# EAGLE design encoder (EAGLE 9.3.1)
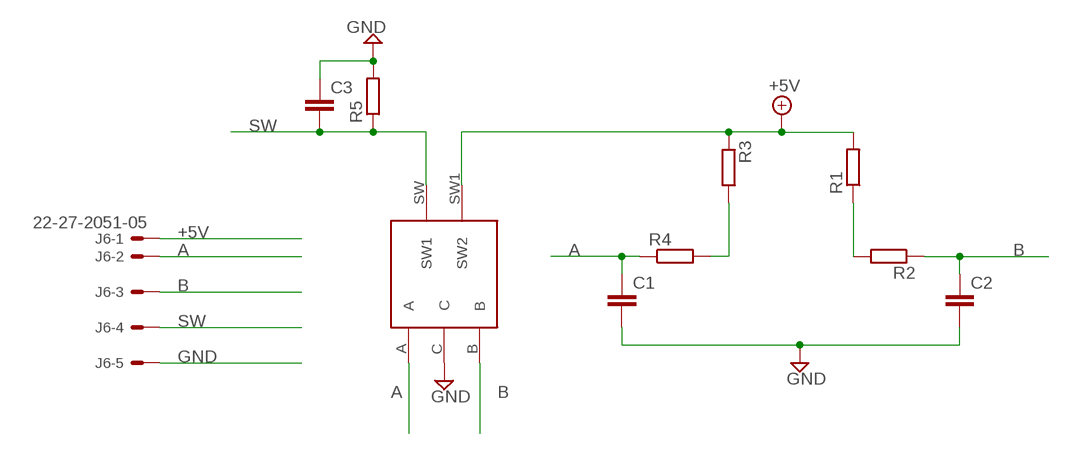
[diagram p0: schematic, sheet 1]

## Parts
C1  C-EUC0805  [C0805]
C2  C-EUC0805  [C0805]
C3  C-EUC0805  [C0805]
J6  22-27-2051-05  [6410-05]
R1  R-EU_MELF0204W  [MINI_MELF-0204W]
R2  R-EU_MELF0204W  [MINI_MELF-0204W]
R3  R-EU_MELF0204W  [MINI_MELF-0204W]
R4  R-EU_MELF0204W  [MINI_MELF-0204W]
R5  R-EU_MELF0204W  [MINI_MELF-0204W]
U$1  BOURNS_ROTARY  [BOURNS_ROTARY]

## Nets
+5V: J6.1 R1.2 R3.1 U$1.SW1(SW2)
A: C1.1 J6.2 R4.1 U$1.A
B: C2.1 J6.3 R2.1 U$1.B
GND: C1.2 C2.2 C3.1 J6.5 R5.2 U$1.C
N$1: R1.1 R2.2
N$2: R3.2 R4.2
SW: C3.2 J6.4 R5.1 U$1.SW(SW1)

## Library data of the parts
C1-C3 = Vwvwbg:C-EU: CAPACITOR, European symbol
J6 = con-molex:22-?-05: CONNECTOR wire to board 2.54 mm (.1 inch) pitch header; MF: MOLEX; OC_FARNELL: unknown; OC_NEWARK: unknown
R1-R5 = Vwvwbg:R-EU_: RESISTOR, European symbol
U$1 = Vwvwbg:BOURNS_ROTARY

## Board
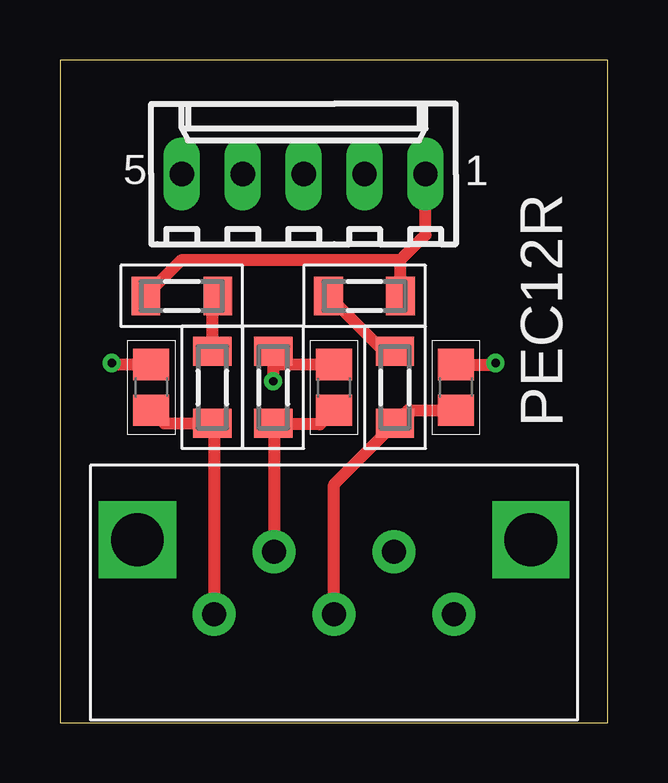
[diagram p1: board, top side]
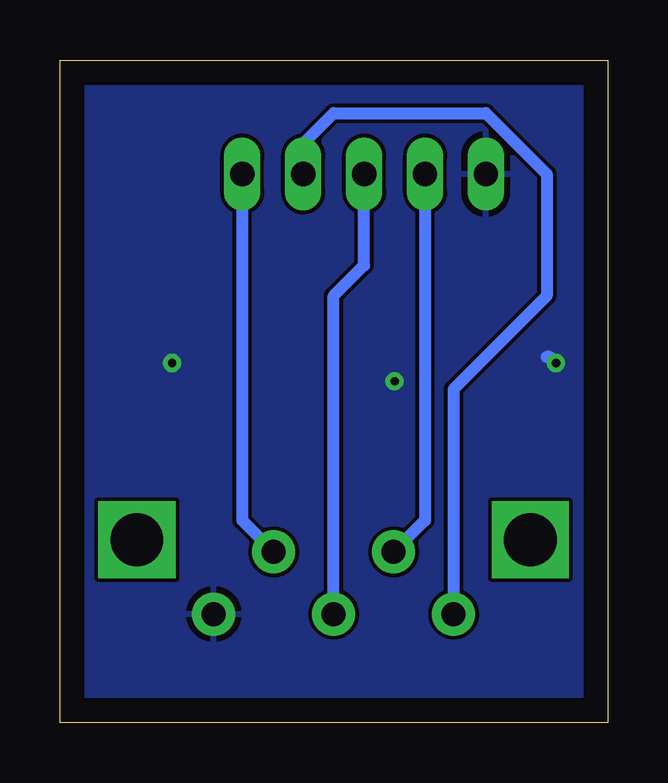
[diagram p2: board, bottom side, seen from below]

Size 22.84 x 27.61 mm. Coordinates in mm from the lower left corner, seen from the top.
Outline: 0,0 22.84,0 22.84,27.61 0,27.61 0,0
Copper layers (1*16): Top 0.035mm / dielectric 1.5mm / Bottom 0.035mm
Design rules "default": minimum track width 6mil, minimum drill 0.35mm, track to track 6mil, track to pad 6mil, pad to pad 6mil, via to via 6mil, smd to smd 6mil, copper to edge 40mil, drill to drill 6mil, minimum pad ring 10mil, minimum via ring 8mil, stop-mask expansion 4mil, vias tented up to drill 0mil, thermal gap 10mil

### Footprints (pad centres in the part's own frame; a part is rotated, then mirrored left to right if it is on the bottom)
C0805 = smd 1.3 x 1.5: 1 -0.95,0; 2 0.95,0
6410-05 = drill 1.016 long: 1 5.08,0; 2 2.54,0; 3 0,0; 4 -2.54,0; 5 -5.08,0
MINI_MELF-0204W = smd 1.2 x 1.6: 1 -1.5,0; 2 1.5,0
BOURNS_ROTARY = drill 1 pad 1.8: A -5,-3.1; B 0,-3.1; C 5,-3.1; SW -2.5,-0.5; SW1 2.5,-0.5 | drill 2.2 pad 3 square: P$6 -8.2,0; P$7 8.2,0

### Placement (x,y rotation side)
C1  3.81,13.97 90 top
C2  16.51,13.97 90 top
C3  11.43,13.97 270 top
J6  10.16,22.86 0 top
R1  12.7,17.78 0 top
R2  13.97,13.97 90 top
R3  5.08,17.78 0 top
R4  6.35,13.97 90 top
R5  8.89,13.97 90 top
U$1  11.43,7.62 0 top

### Tracks (layer width: path | path; a pad name or v marks a point on that pad's centre or on a via)
+5V
  Top 0.508: R1.2 14.2,19.28 | 14.2,19.28 15.24,20.32 J6.1 | R3.1 5.08,19.28 14.2,19.28
  Bottom 0.508: J6.1 15.24,8.43 U$1.SW1
A
  Top 0.508: C1.1 4.36,12.47 R4.1 6.43,12.39 U$1.A
  Bottom 0.508: J6.2 12.7,24.13 11.43,25.4 5.08,25.4 2.54,22.86 2.54,17.78 6.43,13.89 U$1.A
B
  Top 0.508: U$1.B 11.43,9.93 R2.1 14.52,13.02 C2.1
  Bottom 0.508: U$1.B 11.43,17.78 10.16,19.05 J6.3
GND  (via drill 0.35)
  Top 0.508: C1.2 2.22,14.92 v2.16,14.99 | R5.2 8.89,15.24 | 8.89,15.24 v8.89,14.22 | C3.1 9.21,14.92 8.89,15.24 | C2.2 18.09,14.92 v18.16,14.99
  Bottom 0.508: v2.16,14.99 2.41,15.24 2.54,15.24 | v8.89,14.22 8.76,14.22
  pour Bottom: -1.27,27.94 24.13,27.94 24.13,0 -2.54,0 -2.54,27.94
N$1
  Top 0.508: R1.1 13.51,15.47 R2.2
N$2
  Top 0.508: R3.2 6.35,17.55 R4.2
SW
  Top 0.508: R5.1 8.93,12.43 | 8.93,12.43 U$1.SW | C3.2 10.84,12.43 8.93,12.43
  Bottom 0.508: U$1.SW 7.62,8.43 J6.4

### Text on the board
tPlace: PEC12R